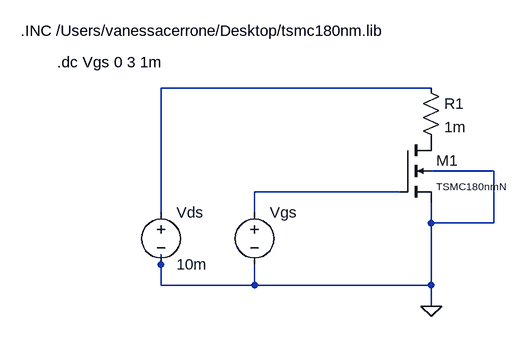
[diagram p0: schematic nmos.asc]
nmos.asc, the LTspice schematic file:
Version 4
SHEET 1 880 680
WIRE 336 144 -80 144
WIRE 432 272 336 272
WIRE 288 304 64 304
WIRE -80 336 -80 144
WIRE 64 336 64 304
WIRE 336 352 336 320
WIRE 432 352 432 272
WIRE 432 352 336 352
WIRE -80 416 -80 400
WIRE -80 448 -80 416
WIRE 64 448 64 416
WIRE 64 448 -80 448
WIRE 336 448 336 352
WIRE 336 448 64 448
WIRE 336 480 336 448
FLAG 336 480 0
SYMBOL nmos4 288 224 R0
WINDOW 3 56 72 Left 1
SYMATTR InstName M1
SYMATTR Value TSMC180nmN
SYMATTR Value2 l=0.18um w=1um
SYMBOL voltage -80 320 R0
SYMATTR InstName Vds
SYMATTR Value 10m
SYMBOL voltage 64 320 R0
WINDOW 3 24 96 Invisible 2
SYMATTR InstName Vgs
SYMATTR Value 1
SYMBOL res 320 128 R0
SYMATTR InstName R1
SYMATTR Value 1m
TEXT -296 56 Left 2 !.INC /Users/vanessacerrone/Desktop/tsmc180nm.lib
TEXT -240 104 Left 2 !.dc Vgs 0 3 1m

The netlist it stands for:
* nmos.asc
M1 P001 N002 0 0 TSMC180nmN l=0.18um w=1um
Vds N001 0 10m
Vgs N002 0 1
R1 N001 P001 1m
.model NMOS NMOS
.model PMOS PMOS
.lib standard.mos
.INC /Users/vanessacerrone/Desktop/tsmc180nm.lib
.dc Vgs 0 3 1m
.backanno
.end